# EAGLE design KO_V3 (EAGLE 9.6.2)
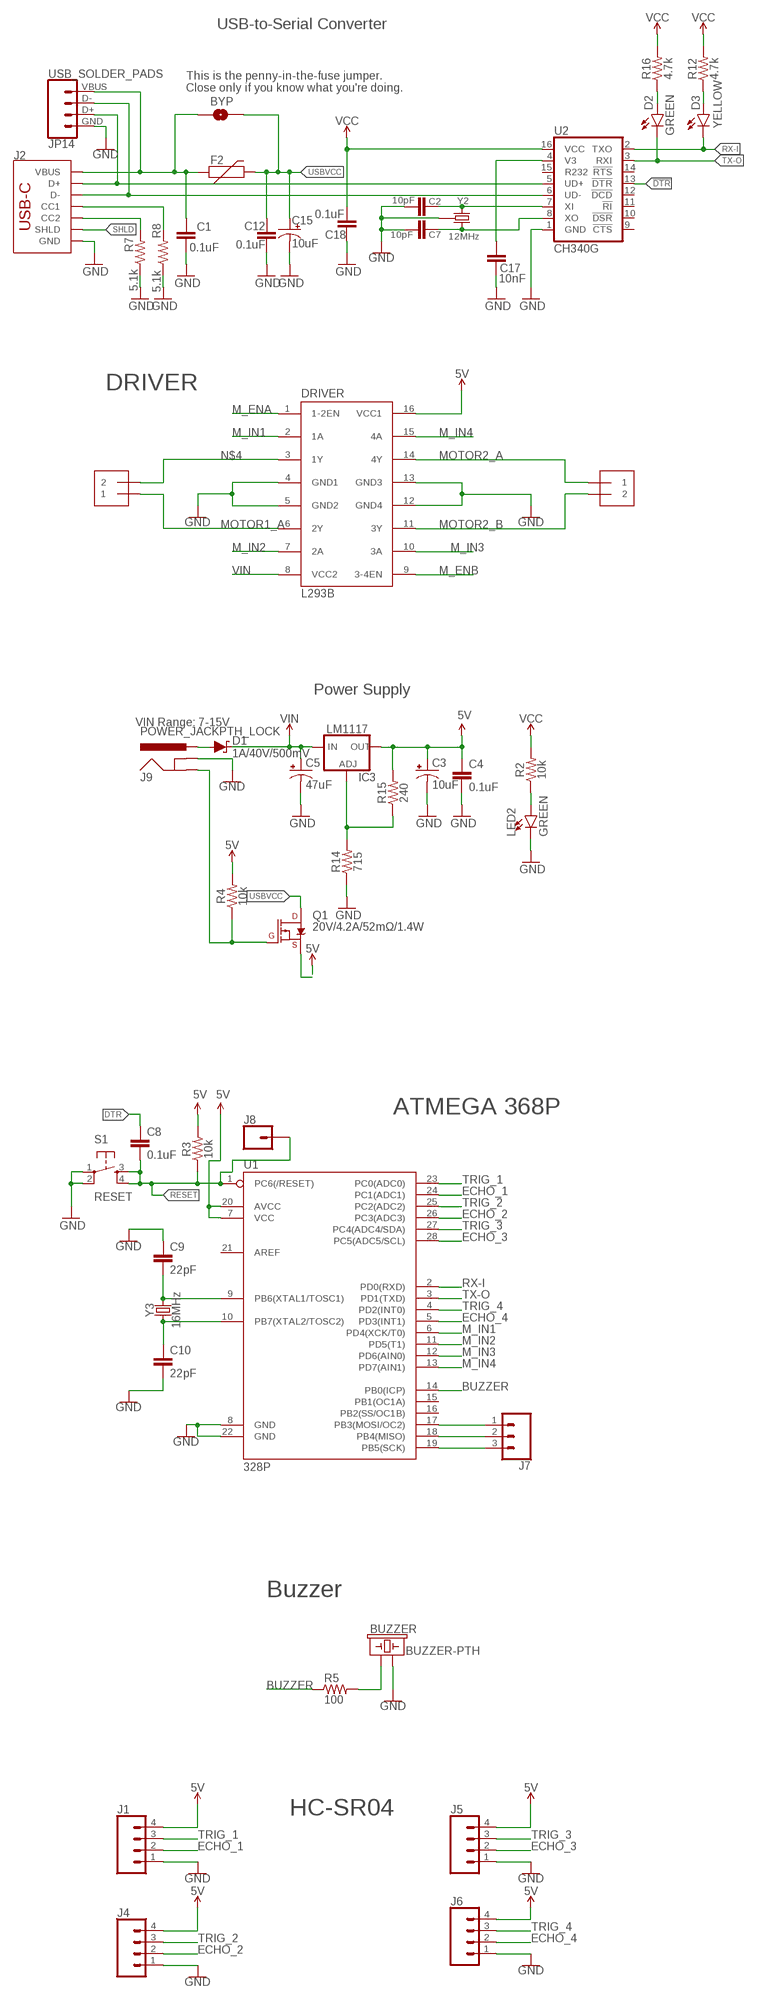
[diagram p0: schematic, sheet 1]

## Parts
BUZZER  BUZZER-PTH  [BUZZER-12MM]
BYP  JUMPER-SMT_2_NO_SILK  [SMT-JUMPER_2_NO_SILK]
C1  0.1uF  0.1UF-0603-25V-(+80/-20%)  [0603]
C2  10pF  10PF-0603-50V-5%  [0603]
C3  10uF  10UF-POLAR-EIA3216-16V-10%(TANT)  [EIA3216]
C4  0.1uF  0.1UF-0603-25V-(+80/-20%)  [0603]
C5  47uF  47UF-POLAR-PANASONIC_D-35V-20%  [PANASONIC_D]
C7  10pF  10PF-0603-50V-5%  [0603]
C8  0.1uF  0.1UF-0603-25V-(+80/-20%)  [0603]
C9  22pF  22PF-0603-50V-5%  [0603]
C10  22pF  22PF-0603-50V-5%  [0603]
C12  0.1uF  0.1UF-0603-25V-(+80/-20%)  [0603]
C15  10uF  10UF-POLAR-EIA3216-16V-10%(TANT)  [EIA3216]
C17  10nF  10NF-0603-50V-10%  [0603]
C18  0.1uF  0.1UF-0603-25V-(+80/-20%)  [0603]
D1  1A/40V/500mV  DIODE-SCHOTTKY-SS14  [SMA-DIODE]
D2  GREEN  LED-GREENLILYPAD  [LED-1206]
D3  YELLOW  LED-YELLOW_HIDDENSILK  [LED-1206-HIDDENSILK]
DRIVER  L293B  L293D  [DIL16]
F2  6V/2A  PPTC_6V2A  [1210]
IC3  LM1117  V_REG_LM1117SOT223  [SOT223]
J1  CONN_04  [1X04]
J2  USB Female Type C Connector  USB_C_2-LAYER_PADS  [USB-C-16P-2LAYER-PADS]
J4  CONN_04  [1X04]
J5  CONN_04  [1X04]
J6  CONN_04  [1X04]
J7  CONN_03LONGPADS  [1X03_LONGPADS]
J8  CONN_01OFFSET  [1X01_OFFSET]
J9  POWER_JACKPTH_LOCK  [POWER_JACK_PTH_LOCK]
JP14  USB_SOLDER_PADS  [USB-SOLDER-PADS]
LED2  GREEN  LED-GREENLILYPAD  [LED-1206]
MOTOR_1  1X2-3.5MM  [1X2-3.5MM]
MOTOR_2  1X2-3.5MM  [1X2-3.5MM]
Q1  20V/4.2A/52mΩ/1.4W  MOSFET_PCH-DMG2305UX-7  [SOT23-3]
R2  10k  10KOHM-0603-1/10W-1%  [0603]
R3  10k  10KOHM-0603-1/10W-1%  [0603]
R4  10k  10KOHM-0603-1/10W-1%  [0603]
R5  100  RC-MASTER-SMD_R_1206MP  [RC-MASTER-SMD_R1206MP]
R7  5.1k  5.1KOHM5.1KOHM-0603-1/10W-1%  [0603]
R8  5.1k  5.1KOHM5.1KOHM-0603-1/10W-1%  [0603]
R12  4.7k  4.7KOHM-0603-1/10W-1%  [0603]
R14  715  715OHM-0603-1/10W-1%  [0603]
R15  240  240OHM-0603-1/10W-1%  [0603]
R16  4.7k  4.7KOHM-0603-1/10W-1%  [0603]
S1  RESET  SWITCH_SPST_4_PINSQUARE  [TACTILE-SWITCH-SMD]
U1  328P  ATMEGA328P_PDIP  [DIP28]
U2  CH340G  CH340GSMD  [SO016]
Y2  12MHz  CRYSTAL-GROUNDEDSMD-3.2X2.5  [CRYSTAL-SMD-3.2X2.5MM]
Y3  16MHz  CRYSTAL-16MHZPTH-HC49US  [HC49US]

## Nets
5V: C3.+ C4.1 DRIVER.16(VCC1) IC3.2(OUT) IC3.4(OUT) J1.4 J4.4 J5.4 J6.4 Q1.2(S) R3.2 R4.2 R15.2 U1.7(VCC) U1.20(AVCC)
!DTR!: U2.13(!DTR)
BUZZER: R5.1 U1.14(PB0(ICP))
CC1: J2.A5(CC1) R8.2
CC2: J2.B5(CC2) R7.2
D+: J2.A6(D+) J2.B6(D+) JP14.D+ U2.5(UD+)
D-: J2.A7(D-) J2.B7(D-) JP14.D- U2.6(UD-)
DTR: C8.1
ECHO_1: J1.2 U1.24(PC1(ADC1))
ECHO_2: J4.2 U1.26(PC3(ADC3))
ECHO_3: J5.2 U1.28(PC5(ADC5/SCL))
ECHO_4: J6.2 U1.5(PD3(INT1))
GND [gnd]: BUZZER.- C1.2 C2.2 C3.- C4.2 C5.- C7.2 C9.1 C10.2 C12.2 C15.- C17.2 C18.2 DRIVER.4(GND1) DRIVER.5(GND2) DRIVER.12(GND4) DRIVER.13(GND3) J1.1 J2.GND J2.GND2(GND) J4.1 J5.1 J6.1 J9.GNDBREAK JP14.GND LED2.C R7.1 R8.1 R14.1 S1.1 S1.2 U1.8(GND) U1.22(GND) U2.1(GND) Y2.2(GND) Y2.4(GND)
INSERT: J9.GND Q1.1(G) R4.1
M_ENA: DRIVER.1(1-2EN)
M_ENB: DRIVER.9(3-4EN)
M_IN1: DRIVER.2(1A) U1.6(PD4(XCK/T0))
M_IN2: DRIVER.7(2A) U1.11(PD5(T1))
M_IN3: DRIVER.10(3A) U1.12(PD6(AIN0))
M_IN4: DRIVER.15(4A) U1.13(PD7(AIN1))
MOTOR1_A: DRIVER.6(2Y) MOTOR_2.1
MOTOR2_A: DRIVER.14(4Y) MOTOR_1.1
MOTOR2_B: DRIVER.11(3Y) MOTOR_1.2
N$1: C17.1 U2.4(V3)
N$2: C7.1 U2.8(XO) Y2.3
N$3: LED2.A R2.1
N$4: DRIVER.3(1Y) MOTOR_2.2
N$5: D2.A R16.1
N$6: BUZZER.+ R5.2
N$8: C2.1 U2.7(XI) Y2.1
N$9: D3.A R12.1
N$10: C9.2 U1.9(PB6(XTAL1/TOSC1)) Y3.2
N$14: C10.1 U1.10(PB7(XTAL2/TOSC2)) Y3.1
N$15: IC3.1(ADJ) R14.2 R15.1
N$23: J7.3 U1.19(PB5(SCK))
N$28: J7.2 U1.18(PB4(MISO))
N$29: J7.1 U1.17(PB3(MOSI/OC2))
PWRIN [power]: D1.A J9.PWR
RESET: C8.2 J8.1 R3.1 S1.3 S1.4 U1.1(PC6(/RESET))
RX-I: D3.C U1.2(PD0(RXD)) U2.2(TXO)
SHLD: J2.SHLD1(SHLD) J2.SHLD2(SHLD) J2.SHLD3(SHLD) J2.SHLD4(SHLD)
TRIG_1: J1.3 U1.23(PC0(ADC0))
TRIG_2: J4.3 U1.25(PC2(ADC2))
TRIG_3: J5.3 U1.27(PC4(ADC4/SDA))
TRIG_4: J6.3 U1.4(PD2(INT0))
TX-O: D2.C U1.3(PD1(TXD)) U2.3(RXI)
USBVCC [power]: BYP.2 C12.1 C15.+ F2.2 Q1.3(D)
VCC: C18.1 R2.2 R12.2 R16.2 U2.16(VCC)
VIN [power]: C5.+ D1.C DRIVER.8(VCC2) IC3.3(IN)
VUSB [power]: BYP.1 C1.1 F2.1 J2.VBUS1(VBUS) J2.VBUS2(VBUS) JP14.VBUS
Unconnected: U1.15(PB1(OC1A)) U1.16(PB2(SS/OC1B)) U1.21(AREF) U2.9(!CTS) U2.10(!DSR) U2.11(!RI) U2.12(!DCD) U2.14(!RTS) U2.15(R232)

## Notes on the sheet
- USB-to-Serial Converter
- This is the penny-in-the-fuse jumper.
  Close only if you know what you're doing.
- DRIVER
- Power Supply
- VIN Range: 7-15V
- ATMEGA 368P
- Buzzer
- HC-SR04

## Library data of the parts
BUZZER = SparkFun-Electromechanical:BUZZER: Buzzer Small round buzzers that operate around the audible 2kHz range. You can use these as speakers to create simple music or user interfaces. Variant Overview: PTH - Mini Speaker - PC Mount 12mm 2.048kHz <https://www.sparkfun.com/products/7950> PTH_KIT - Mini Speaker - PC Mount 12mm 2.048kHz <https://www.sparkfun.com/products/7950> KIT simplifies soldering by adding stop mask to one side of the pads. PTH_NO_SILK - Mini Speaker - PC Mount 12mm 2.048kHz <https://www.sparkfun.com/products/7950> No silkscreen indicator of buzzer outline. PTH_KIT_NO_SILK - Mini Speaker - PC Mount 12mm 2.048kHz <https://www.sparkfun.com/products/7950> KIT package w/o silkscreen SMD - Buzzer Audio Magnetic (CCV-084B16) SMD buzzer used on, e.g. the LilyPad Buzzer <https://www.sparkfun.com/products/8463> and RFID USB Reader <https://www.sparkfun.com/products/9963>. SMD_KIT - Buzzer Audio Magnetic (CCV-084B16) SMD Buzzer with elongated pins to make soldering easier. Used on the SparkFun Simon Says - Surface Mount Soldering Kit <https://www.sparkfun.com/products/10935>.; PROD_ID: COMP-08253; SF_SKU: COM-07950
BYP = SparkFun-Jumpers:JUMPER-SMT_2_NO: Normally open jumper This jumper has two pads in close proximity to each other. Apply solder to close the connection. Round pads are easier to solder for beginners, but are a lot larger. SparkFun Product that uses the round pads: SparkFun EL Sequencer <https://www.sparkfun.com/products/12781>
C1 C4 C8 C12 C18 = SparkFun-Capacitors:0.1UF: 0.1µF ceramic capacitors A capacitor is a passive two-terminal electrical component used to store electrical energy temporarily in an electric field.; PROD_ID: CAP-00810
C2 C7 = SparkFun-Capacitors:10PF: 10pF ceramic capacitors A capacitor is a passive two-terminal electrical component used to store electrical energy temporarily in an electric field.; PROD_ID: CAP-11812
C3 C15 = SparkFun-Capacitors:10UF-POLAR: 10.0µF polarized capacitors A capacitor is a passive two-terminal electrical component used to store electrical energy temporarily in an electric field.; PROD_ID: CAP-00811
C5 = SparkFun-Capacitors:47UF-POLAR: 47µF polarized capacitors A capacitor is a passive two-terminal electrical component used to store electrical energy temporarily in an electric field.; PROD_ID: CAP-08478
C9 C10 = SparkFun-Capacitors:22PF: 22pF ceramic capacitors A capacitor is a passive two-terminal electrical component used to store electrical energy temporarily in an electric field.; PROD_ID: CAP-07876
C17 = SparkFun-Capacitors:10NF: 0.01uF/10nF/10,000pF ceramic capacitors A capacitor is a passive two-terminal electrical component used to store electrical energy temporarily in an electric field. CAP-09321; PROD_ID: CAP-00867
D1 = SparkFun-DiscreteSemi:DIODE-SCHOTTKY: Schottky diode A Schottky diode is a semiconductor diode which has a low forward voltage drop and a very fast switching action.; PROD_ID: DIO-08053
D2 LED2 = SparkFun-LED:LED-GREEN: Green SMD LED Used in manufacturing of various products at SparkFun Packages: 0603 - SMD 0603 package [Product Link] <http://www.futureelectronics.com/en/technologies/semiconductors/optoelectronics/leds/Pages/9894312-LTST-C190GKT.aspx?CrossPart=HSMG-C190&IM=0> LilyPad 1206 - SMD1206 LilyPad package [Product Link] <http://www.futureelectronics.com/en/Technologies/Product.aspx?ProductID=IN150NGHARVATEKCORPORATION2049943&IM=0> 1206 - SMD1206 package [Product Link] <http://www.futureelectronics.com/en/technologies/semiconductors/optoelectronics/leds/Pages/8315665-LTST-C150KGKT.aspx?IM=0> 1206 Bottom Mount -SMD 1206 Bottom Mount [Product Link] <http://www.digikey.com/product-detail/en/lite-on-inc/LTST-C230KGKT/160-1456-1-ND/386854> SparkFun Products: Pro Mini 328 -5V <https://www.sparkfun.com/products/821> RedBoard <https://www.sparkfun.com/products/12757> MP3 Trigger <https://www.sparkfun.com/products/13720> Makey Makey <https://www.sparkfun.com/products/11076>; PROD_ID: DIO-09910
D3 = SparkFun-LED:LED-YELLOW: Yellow SMD LED Used in manufacturing several products at SparkFun. Packages: 0603 - SMD 0603 package[Product Link] <http://www.kingbrightusa.com/product.asp?catalog_name=LED&product_id=APT1608SYCK> 0603 -SMART - SMART SMD 0603 package (more efficient/more expensive) [Product Link] <http://www.osram-os.com/osram_os/en/products/product-catalog/led-light-emitting-diodes/smartled-0603/ly-l29k/index.jsp> LilyPad - SMD1206 package[Product Datasheet] <https://www.sparkfun.com/datasheets/DevTools/LilyPad/Q150YUS4.pdf> SparkFun Products: Blynk Board <https://www.sparkfun.com/products/13794> IOIO-OTG <https://www.sparkfun.com/products/13613> XBee Explorer Serial <https://www.sparkfun.com/products/13225>; PROD_ID: DIO-09909
DRIVER = st-microelectronics:L293D: PUSH-PULL 4 CHANNEL DRIVER; MPN: L293D; OC_FARNELL: 9589619; OC_NEWARK: 56P8249
F2 = SparkFun-Fuses:PPTC: Resettable Fuse PPTC Resettable Fuse. Really a sort of resistor with a polymeric positive temperature coefficient whose resistance increases dramatically with an increase in temperature. When heated by the power passing through the resistance rises causing the current to be limited, protecting the circuit. This is achieved by the transition of the polymer from a crystalline to an amorphous state where the conductive carbon separates breaking the conductive pathways found in the cool crystalline structure. When a PPTC cools back down it resumes conducting letting the circuit turn back on. SparkFun Products: SparkFun RedBoard - Programmed with Arduino <https://www.sparkfun.com/products/12757> Pro Micro - 5V/16MHz <https://www.sparkfun.com/products/12640> Arduino Pro 328 - 5V/16MHz <https://www.sparkfun.com/products/10915> MP3 Trigger <https://www.sparkfun.com/products/13720>; PROD_ID: RES-14313
IC3 = SparkFun-IC-Power:V_REG_LM1117: Voltage Regulator LM1117 Standard adjustable voltage regulator but in SMD form. Spark Fun Electronics SKU : COM-00595; PROD_ID: VREG-08170
J1 J4-J6 = SparkFun-Connectors:CONN_04: Multi connection point. Often used as Generic Header-pin footprint for 0.1 inch spaced/style header connections On any of the 0.1 inch spaced packages, you can populate with these: Break Away Headers - Straight <https://www.sparkfun.com/products/116> (PRT-00116) Break Away Male Headers - Right Angle <https://www.sparkfun.com/products/553> (PRT-00553) Female Headers <https://www.sparkfun.com/products/115> (PRT-00115) Break Away Headers - Machine Pin <https://www.sparkfun.com/products/117> (PRT-00117) Break Away Female Headers - Swiss Machine Pin <https://www.sparkfun.com/products/743> (PRT-00743) For SCREWTERMINALS and SPRING TERMINALS visit here: Screw Terimnals on SparkFun.com <https://www.sparkfun.com/search/results?term=Screw+Terminals> (5mm/3.5mm/2.54mm spacing) This device is also useful as a general connection point to wire up your design to another part of your project. Our various solder wires solder well into these plated through hole pads. Hook-Up Wire - Assortment (Stranded, 22 AWG) <https://www.sparkfun.com/products/11375> (PRT-11375) Hook-Up Wire - Assortment (Solid Core, 22 AWG) <https://www.sparkfun.com/products/11367> (PRT-11367) View the entire wire category on our website here <https://www.sparkfun.com/categories/141> Special notes: Molex polarized connector foot print use with SKU : PRT-08231 with associated crimp pins and housings. 1MM SMD Version SKU: PRT-10208; PROD_ID: CONN-09696
J2 = SparkFun-Connectors:USB_C: USB Type C 16Pin Connector Super Speed pins not available on the 16-pin purely SMD connector so this part is best for USB 2.0 implementations. D1 and D2 are tied together enabling D+/- no matter which way the cable is plugged into the connector. The two channel configuration pins (CC1/2) are exposed. These are normally connected to ground via 5.1k resistors but can be reconfigured for high current/high power applications. **4-LAYER BOARD WARNING!!** If designing 4-layer board, make sure to select the variant _4-LAYER-ISOLATED. The linked footprint (USB-C-16-4LAYER-ISOLATED) includes some very necessary cutout polygons in the inner layers (2 and 15). This prevents the PTH mounting shield legs on the USB connector from electrically connecting any other polygons on the inner layers (usually VCC and GND).; PROD_ID: CONN-14122
J7 = SparkFun-Connectors:CONN_03: Multi connection point. Often used as Generic Header-pin footprint for 0.1 inch spaced/style header connections On any of the 0.1 inch spaced packages, you can populate with these: Break Away Headers - Straight <https://www.sparkfun.com/products/116> (PRT-00116) Break Away Male Headers - Right Angle <https://www.sparkfun.com/products/553> (PRT-00553) Female Headers <https://www.sparkfun.com/products/115> (PRT-00115) Break Away Headers - Machine Pin <https://www.sparkfun.com/products/117> (PRT-00117) Break Away Female Headers - Swiss Machine Pin <https://www.sparkfun.com/products/743> (PRT-00743) Stackable Header - 3 Pin (Female, 0.1") <https://www.sparkfun.com/products/13875> (PRT-13875) For SCREWTERMINALS and SPRING TERMINALS visit here: Screw Terimnals on SparkFun.com <https://www.sparkfun.com/search/results?term=Screw+Terminals> (5mm/3.5mm/2.54mm spacing) This device is also useful as a general connection point to wire up your design to another part of your project. Our various solder wires solder well into these plated through hole pads. Hook-Up Wire - Assortment (Stranded, 22 AWG) <https://www.sparkfun.com/products/11375> (PRT-11375) Hook-Up Wire - Assortment (Solid Core, 22 AWG) <https://www.sparkfun.com/products/11367> (PRT-11367) View the entire wire category on our website here <https://www.sparkfun.com/categories/141> Special notes: Molex polarized connector foot print use with SKU : PRT-08232 with associated crimp pins and housings.
J8 = SparkFun-Connectors:CONN_01: Single connection point. Often used as Generic Header-pin footprint for 0.1 inch spaced/style header connections On any of the 0.1 inch spaced packages, you can populate with these: Break Away Headers - Straight <https://www.sparkfun.com/products/116> (PRT-00116) Break Away Male Headers - Right Angle <https://www.sparkfun.com/products/553> (PRT-00553) Female Headers <https://www.sparkfun.com/products/115> (PRT-00115) Break Away Headers - Machine Pin <https://www.sparkfun.com/products/117> (PRT-00117) Break Away Female Headers - Swiss Machine Pin <https://www.sparkfun.com/products/743> (PRT-00743) This device is also useful as a general connection point to wire up your design to another part of your project. Our various solder wires solder well into these plated through hole pads. Hook-Up Wire - Assortment (Stranded, 22 AWG) <https://www.sparkfun.com/products/11375> (PRT-11375) Hook-Up Wire - Assortment (Solid Core, 22 AWG) <https://www.sparkfun.com/products/11367> (PRT-11367) View the entire wire category on our website here <https://www.sparkfun.com/categories/141> Special notes: SMTSO-256-ET is a "flush mount" nut for a 4-40 screw. We mostly use this on specialty testbeds; it is a nice way to connect hardware to your PCB at an adjustable hieght. Also note, the SNAP packages are for using a snappable style connector. We sell a baggie of snaps and they are also used on two LilyPad designs: Snap Assortment - 30 pack (male and female) <https://www.sparkfun.com/products/11347> (DEV-11347) LilyPad Arduino SimpleSnap <https://www.sparkfun.com/products/10941> (DEV-10941) LilyPad SimpleSnap Protoboard <https://www.sparkfun.com/products/10940> (DEV-10940)
J9 = SparkFun-Connectors:POWER_JACK: Power Jack Connector This is the standard 5.5mm barrel jack for power. The PTH is the most common, proven, reliable, footprint. The Slot footprint only works if the mill layer is transmitted to the PCB fab house so be warned. Here are the connectors we sell at SparkFun: DC Barrel Power Jack/Connector <https://www.sparkfun.com/products/119> (PRT-00119) DC Barrel Power Jack/Connector (SMD) <https://www.sparkfun.com/products/12748> (PRT-12748) DC Barrel Jack Adapter - Breadboard Compatible <https://www.sparkfun.com/products/10811> (PRT-10811) It is used on this SparkFun product (and many, many others): SparkFun RedBoard - Programmed with Arduino <https://www.sparkfun.com/products/12757> (DEV-12757) Also, if you need a mating power supply or connector, please check these out: Wall Adapter Power Supply - 9VDC 650mA <https://www.sparkfun.com/products/298> (TOL-00298) DC Barrel Jack Adapter - Male <https://www.sparkfun.com/products/10287> (PRT-10287); PROD_ID: CONN-08197; SF_ID: PRT-00119
JP14 = SparkFun-Connectors:USB_SOLDER_PADS: Solder pad access to USB pins. Helpful to expose on PCBs so user can attach external USB connector if necessary.
MOTOR_1 MOTOR_2 = adafruit:1X2: 3.5mm Terminal block http://www.ladyada.net/library/pcb/eaglelibrary.html
Q1 = SparkFun-DiscreteSemi:MOSFET_PCH: P-channel MOSFETs Voltage controlled devices that allow control of high current outputs. SparkFun Products: SparkFun ESP32 Thing <https://www.sparkfun.com/products/13907> SparkFun ESP8266 Thing <https://www.sparkfun.com/products/13231> SparkFun Pi Servo HAT V2 <https://www.sparkfun.com/products/15316> DMG2305UX-7 (20V/4.2A/SOT23-3); PROD_ID: TRANS-14388
R2-R4 = SparkFun-Resistors:10KOHM: 10kΩ resistor A resistor is a passive two-terminal electrical component that implements electrical resistance as a circuit element. Resistors act to reduce current flow, and, at the same time, act to lower voltage levels within circuits. - Wikipedia; PROD_ID: RES-00824
R5 = 52101-101-REV-A_v16:RC-MASTER-SMD_R_: RESISTOR
R7 R8 = SparkFun-Resistors:5.1KOHM; PROD_ID: RES-12083
R12 R16 = SparkFun-Resistors:4.7KOHM: 4.7kΩ resistor A resistor is a passive two-terminal electrical component that implements electrical resistance as a circuit element. Resistors act to reduce current flow, and, at the same time, act to lower voltage levels within circuits. - Wikipedia; PROD_ID: RES-07857
R14 = SparkFun-Resistors:715OHM: 715Ω resistor A resistor is a passive two-terminal electrical component that implements electrical resistance as a circuit element. Resistors act to reduce current flow, and, at the same time, act to lower voltage levels within circuits. - Wikipedia; PROD_ID: RES-07850
R15 = SparkFun-Resistors:240OHM: 240Ω resistor A resistor is a passive two-terminal electrical component that implements electrical resistance as a circuit element. Resistors act to reduce current flow, and, at the same time, act to lower voltage levels within circuits. - Wikipedia; PROD_ID: RES-07849
S1 = SparkFun-Electromechanical:SWITCH_SPST_4_PIN; PROD_ID: SWCH-08247
U1 = SparkFun-IC-Microcontroller:ATMEGA328P_PDIP: Atmel 328P Through hole ATMEGA328P uC used in the Arduino 32kb flash, 1k EEPROM, 2k SRAM Datasheet <http://www.sparkfun.com/datasheets/Components/SMD/ATMega328.pdf> SparkFun Products Storefront component: AVR 28 Pin 20MHz 32K 6A/D - ATMega328P <https://www.sparkfun.com/products/9061> (COM-09061) SparkFun Simon Says - Through-Hole Soldering Kit <https://www.sparkfun.com/products/10547> (KIT-10547) SparkFun Learn to Solder - Simon Says <https://www.sparkfun.com/products/13708> (KIT-13708) SparkFun BigTime Watch Kit <https://www.sparkfun.com/products/11734> (KIT-11734) SparkFun ClockIt <https://www.sparkfun.com/products/10930> (KIT-10930) SparkFun Serial Enabled LCD Kit <https://www.sparkfun.com/products/10097> (LCD-10097) SparkFun Simon Tilts - Through Hole Soldering Kit <https://www.sparkfun.com/products/12634> (KIT-12634) SparkFun Frequency Counter Kit <https://www.sparkfun.com/products/10140> (KIT-10140) FabFM Radio Kit <https://www.sparkfun.com/products/11043> (KIT-11043) SparkFun Binary Blaster Kit <https://www.sparkfun.com/products/12037> (KIT-12037) SparkFun Metro-Gnome <https://www.sparkfun.com/products/9236> (KIT-09236) ATmega328 with Arduino Optiboot (Uno) <https://www.sparkfun.com/products/10524> (DEV-10524); PROD_ID: IC-09136
U2 = SparkFun-IC-Comms:CH340G: A simple USB 2.0 to Serial IC.; PROD_ID: IC-13498
Y2 = SparkFun-Clocks:CRYSTAL-GROUNDED: Crystals w/ Ground Pin (Generic) These are passive quartz crystals, which can be used as a clock source for a microcontroller. Crystal's are usually two-terminal devices. A third terminal may be optionally connected to ground, as recommended by the manufaturer.; PROD_ID: XTAL-13518
Y3 = SparkFun-Clocks:CRYSTAL-16MHZ: 16MHz Crystal Digikey Example <http://www.digikey.com/product-search/en?keywords=535-9122-1-ND> Frequency: 16MHz Frequency Stability: ±50ppm Frequency Tolerance: ±20ppm Load Capacitance: 18pF SparkFun Products: Pro Micro -5V/16MHz <https://www.sparkfun.com/products/12640> SparkFun Serial Enabled LCD Kit <https://www.sparkfun.com/products/10097>; PROD_ID: XTAL-08181; SF_ID: COM-00536

## Net classes
0 default: width 0 mm, drill 0 mm
1 power: width 0.762 mm
2 gnd: width 0.305 mm, drill 0.559 mm, clearance 0.254 mm

## Board
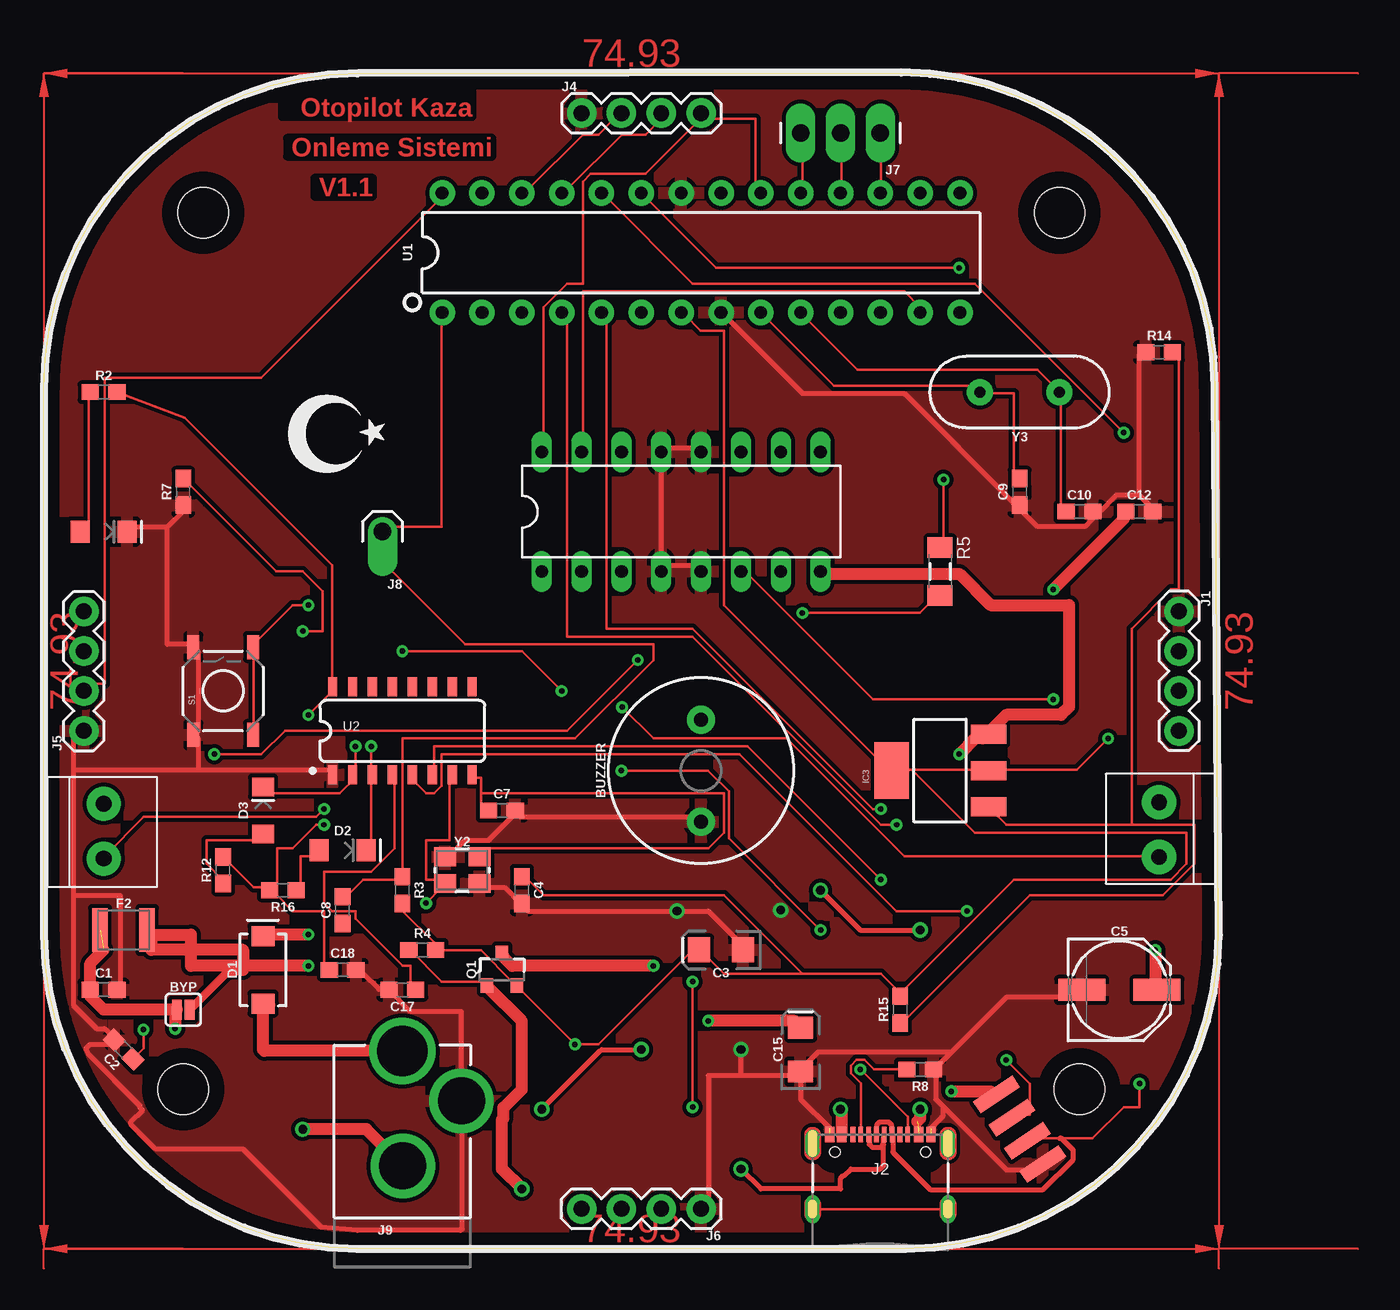
[diagram p1: board, top side]
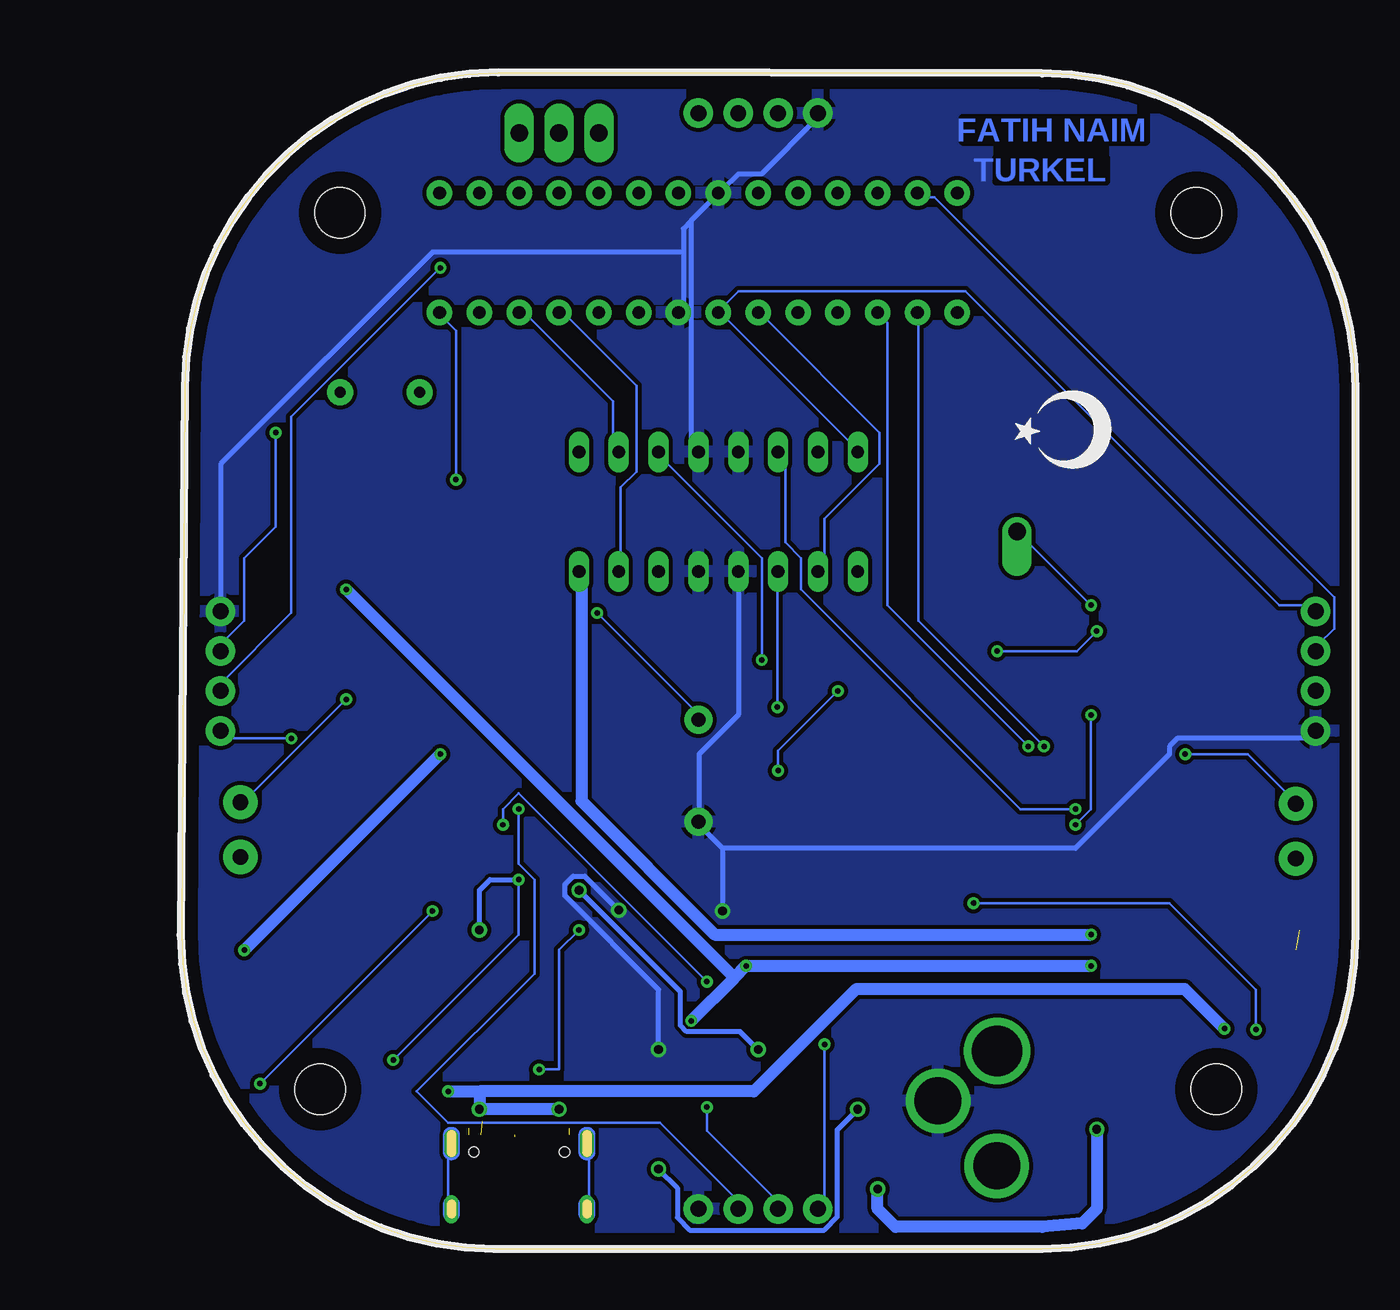
[diagram p2: board, bottom side, seen from below]

Size 74.87 x 74.93 mm. Coordinates in mm from the lower left corner, seen from the top.
Outline: 20,74.93 54.67,74.93 arc-90 74.67,55 74.87,20.07 arc-90 54.87,0 20,0 arc-90 0,20 0,54.93 arc-90 20,74.93
Copper layers (1*16): Top 0.035mm / dielectric 1.5mm / Bottom 0.035mm
Design rules "default": minimum track width 6mil, minimum drill 0.35mm, track to track 6mil, track to pad 6mil, pad to pad 6mil, via to via 6mil, smd to smd 6mil, copper to edge 40mil, drill to drill 6mil, minimum pad ring 10mil, minimum via ring 8mil, stop-mask expansion 4mil, vias tented up to drill 0mil, thermal gap 10mil
Holes 3.2 mm at 10.16,66.04 8.89,10.16 66.04,10.16 64.77,66.04

### Footprints (pad centres in the part's own frame; a part is rotated, then mirrored left to right if it is on the bottom)
BUZZER-12MM = drill 0.9 pad 1.778: + 3.25,0; - -3.25,0
SMT-JUMPER_2_NO_SILK = smd 0.635 x 1.27: 1 -0.406,0; 2 0.406,0
0603 = smd 1.1 x 1: 1 -0.85,0; 2 0.85,0
EIA3216 = smd 1.4 x 1.6: + 1.4,0; - -1.4,0
PANASONIC_D = smd 3 x 1.4: + 2.4,0; - -2.4,0
SMA-DIODE = smd 1.27 x 1.47: A -2.15,0; C 2.15,0
LED-1206 = smd 1.2 x 1.4: A -1.5,0; C 1.5,0
LED-1206-HIDDENSILK = smd 1.2 x 1.4: A -1.5,0; C 1.5,0
DIL16 = drill 0.813 long: 1 -8.89,-3.81; 2 -6.35,-3.81; 3 -3.81,-3.81; 4 -1.27,-3.81; 5 1.27,-3.81; 6 3.81,-3.81; 7 6.35,-3.81; 8 8.89,-3.81; 9 8.89,3.81; 10 6.35,3.81; 11 3.81,3.81; 12 1.27,3.81; 13 -1.27,3.81; 14 -3.81,3.81; 15 -6.35,3.81; 16 -8.89,3.81
1210 = smd 1 x 2.8: 1 -1.5,0; 2 1.5,0
SOT223 = smd 1.219 x 2.235: 1 -2.311,-3.099; 2 0,-3.099; 3 2.311,-3.099 | smd 3.6 x 2.2: 4 0,3.099
1X04 = drill 1.016 pad 1.88: 1 0,0; 2 2.54,0; 3 5.08,0; 4 7.62,0
USB-C-16P-2LAYER-PADS = smd 0.3 x 1: A5 -1.25,-0.34; A6 -0.25,-0.34; A7 0.25,-0.34; A8 1.25,-0.34; B5 1.75,-0.34; B6 0.75,-0.34; B7 -0.75,-0.34; B8 -1.75,-0.34 | smd 0.6 x 1: GND -3.225,-0.34; GND2 3.225,-0.34; VBUS1 -2.45,-0.34; VBUS2 2.45,-0.34 | drill 0.4 pad 0.6 long: SHLD1 -4.318,-0.915; SHLD2 4.318,-0.915; SHLD3 -4.318,-5.095; SHLD4 4.318,-5.095 | hole 0.65: -2.89,-1.445; 2.89,-1.445
1X03_LONGPADS = drill 1.118 pad 1.88 long: 1 0,0; 2 2.54,0; 3 5.08,0
1X01_OFFSET = drill 1.118 pad 1.88 offset: 1 0,0
POWER_JACK_PTH_LOCK = drill 2.997 pad 4.115: GND 0.025,6.557; GNDBREAK 3.762,10.7 | drill 3.2 pad 4.115: PWR 0,13.878
USB-SOLDER-PADS = smd 3 x 0.9: D+ 0,-0.889; D- 0,0.889; GND 0,-2.667; VBUS 0,2.667
1X2-3.5MM = drill 1 pad 2.184: 1 1.8,0; 2 -1.7,0
SOT23-3 = smd 0.8 x 0.9: 1 -0.95,-1; 2 0.95,-1; 3 0,1.1
RC-MASTER-SMD_R1206MP = smd 1.3 x 1.6: 1 -1.524,0; 2 1.524,0
TACTILE-SWITCH-SMD = smd 1.524 x 0.762: 1 -2.794,1.905; 2 2.794,1.905; 3 -2.794,-1.905; 4 2.794,-1.905
DIP28 = drill 0.813 pad 1.626: 1 -16.51,-3.81; 2 -13.97,-3.81; 3 -11.43,-3.81; 4 -8.89,-3.81; 5 -6.35,-3.81; 6 -3.81,-3.81; 7 -1.27,-3.81; 8 1.27,-3.81; 9 3.81,-3.81; 10 6.35,-3.81; 11 8.89,-3.81; 12 11.43,-3.81; 13 13.97,-3.81; 14 16.51,-3.81; 15 16.51,3.81; 16 13.97,3.81; 17 11.43,3.81; 18 8.89,3.81; 19 6.35,3.81; 20 3.81,3.81; 21 1.27,3.81; 22 -1.27,3.81; 23 -3.81,3.81; 24 -6.35,3.81; 25 -8.89,3.81; 26 -11.43,3.81; 27 -13.97,3.81; 28 -16.51,3.81
SO016 = smd 0.6 x 1.2: 1 -4.445,-2.8; 2 -3.175,-2.8; 3 -1.905,-2.8; 4 -0.635,-2.8; 5 0.635,-2.8; 6 1.905,-2.8; 7 3.175,-2.8; 8 4.445,-2.8; 9 4.445,2.8; 10 3.175,2.8; 11 1.905,2.8; 12 0.635,2.8; 13 -0.635,2.8; 14 -1.905,2.8; 15 -3.175,2.8; 16 -4.445,2.8
CRYSTAL-SMD-3.2X2.5MM = smd 1.4 x 1.2: 1 -1.1,-0.85; 2 1.1,-0.85; 3 1.1,0.85; 4 -1.1,0.85
HC49US = drill 0.7 pad 1.651: 1 -2.54,0; 2 2.54,0

### Placement (x,y rotation side)
BUZZER  41.91,30.48 90 top
BYP  8.89,15.24 0 top
C1  3.81,16.51 0 top
C2  5.08,12.7 135 top
C3  43.18,19.05 180 top
C4  30.48,22.86 270 top
C5  68.58,16.51 0 top
C7  29.21,27.94 0 top
C8  19.05,21.59 90 top
C9  62.23,48.26 90 top
C10  66.04,46.99 0 top
C12  69.85,46.99 0 top
C15  48.26,12.7 90 top
C17  22.86,16.51 180 top
C18  19.05,17.78 0 top
D1  13.97,17.78 90 top
D2  19.05,25.4 0 top
D3  13.97,27.94 90 top
DRIVER  40.64,46.99 0 top
F2  5.08,20.32 0 top
IC3  57.15,30.48 90 top
J1  72.39,40.64 270 top
J2  53.34,7.62 0 top
J4  34.29,72.39 0 top
J5  2.54,33.02 90 top
J6  41.91,2.54 180 top
J7  53.34,71.12 180 top
J8  21.59,45.72 180 top
J9  22.86,-1.27 0 top
JP14  62.23,7.62 33.7 top
LED2  3.81,45.72 0 top
MOTOR_1  3.81,26.67 270 top
MOTOR_2  71.12,26.67 90 top
Q1  29.21,17.78 0 top
R2  3.81,54.61 0 top
R3  22.86,22.86 270 top
R4  24.13,19.05 0 top
R5  57.15,43.18 270 top
R7  8.89,48.26 90 top
R8  55.88,11.43 180 top
R12  11.43,24.13 90 top
R14  71.12,57.15 0 top
R15  54.61,15.24 90 top
R16  15.24,22.86 180 top
S1  11.43,35.56 90 top
U1  41.91,63.5 0 top
U2  22.86,33.02 0 top
U$2  [TR_MINI]  14.39,48.91 0 top
U$4  [TR_MINI]  14.39,55.26 180 bottom
Y2  26.67,24.13 0 top
Y3  62.23,54.61 180 top

### Tracks (layer width: path | path; a pad name or v marks a point on that pad's centre or on a via)
5V  (via drill 0.35)
  Top 0.152: 48.37,17.53 43.37,17.53 41.87,19.03 C3.+ 41.37,19.03 35.37,13.03 v33.87,13.03 30.37,16.53 Q1.2 29.87,17.03 27.87,19.03 25.37,19.03 R4.2 24.87,19.53 22.87,21.53 R3.2 | 48.37,17.53 53.37,17.53 54.37,16.53 R15.2 54.87,16.53 61.87,23.53 71.87,23.53 72.87,24.53 72.87,26.53 59.37,26.53 55.37,30.53 | 48.37,17.53 43.37,22.53 31.87,22.53 30.87,23.53 C4.1 | 55.37,30.53 54.37,30.53 IC3.4 53.87,30.53 43.37,41.03 43.37,58.53 41.87,58.53 40.87,59.53 U1.7 | 55.37,30.53 59.87,30.53 IC3.2 60.37,30.53 65.87,30.53 v67.87,32.53 | U1.20 45.37,67.53 45.37,72.03 42.37,72.03 J4.4 41.87,72.03 38.37,68.53 34.87,68.53 34.37,68.03 34.37,61.53 33.37,61.53 31.87,60.03 31.87,51.03 DRIVER.16
  Bottom 0.152: v33.87,13.03 33.87,3.03 J6.4 | v67.87,32.53 72.37,32.53 J1.4 | DRIVER.16 31.87,51.03 40.37,59.53 U1.7 40.37,60.03 39.37,61.03 24.87,61.03 4.87,41.03 2.87,41.03 J5.4
BUZZER  (via drill 0.35)
  Top 0.152: v57.37,49.03 57.37,45.03 R5.1
  Bottom 0.152: v57.37,49.03 57.37,58.53 58.37,59.53 U1.14
CC1
  Top 0.152: R8.2 52.93,11.43 52.32,12.04 51.82,12.04 51.46,11.68 51.46,11.18 52.09,10.55 J2.A5
CC2  (via drill 0.35)
  Top 0.152: R7.2 14.82,43.18 16.51,43.18 17.78,41.91 17.78,39.37 v16.51,39.37 | v22.86,38.1 30.48,38.1 v33.02,35.56 | v49.53,20.32 43.68,26.17 43.68,29.16 42.35,30.48 v36.83,30.48 | v52.07,11.43 55.09,8.41 J2.B5
  Bottom 0.152: v16.51,39.37 17.78,38.1 v22.86,38.1 | v33.02,35.56 36.83,31.75 v36.83,30.48 | v49.53,20.32 50.8,19.05 50.8,11.43 v52.07,11.43
D+  (via drill 0.35)
  Top 0.152: v58.87,21.53 54.37,21.53 44.37,31.53 25.37,31.53 25.37,29.53 24.87,29.03 24.37,29.03 23.37,30.03 U2.5 | v69.87,10.53 69.87,9.03 68.87,9.03 66.87,7.03 64.77,7.03 62.87,7.03 JP14.D+
  Top 0.305: J2.A6 53.14,7.33 53.14,7.91 53.31,8.09 53.87,8.09 54.05,7.91 54.05,7.33 J2.B6 54.14,7.23 54.14,6.16 56.53,3.76 63.72,3.76 65.64,5.68 65.64,6.29 64.9,7.03 64.77,7.03
  Bottom 0.152: v69.87,10.53 v58.87,21.53
D-  (via drill 0.35, 0.56)  (1 unrouted)
  Top 0.152: v53.37,23.53 44.87,32.03 24.87,32.03 24.87,30.53 U2.6 | v61.37,12.03 62.87,10.53 62.87,8.53 61.87,8.53 JP14.D-
  Top 0.305: 53.55,6.65 53.37,6.47 52.81,6.47 52.63,6.66 52.63,7.24 J2.B7 | 53.55,6.65 53.55,7.09 53.59,7.13 | v44.45,5.08 45.72,3.81 50.8,3.81 50.8,4.49 50.99,4.68 51.07,4.68 51.47,5.08 53.34,5.08 53.55,5.28 53.55,6.65 | v31.75,8.89 35.51,12.65 35.53,12.65 35.58,12.7 v38.1,12.7 | v49.53,22.86 52.07,20.32 v55.88,20.32
  Bottom 0.152: v53.37,23.53 53.37,20.03 v61.37,12.03
  Bottom 0.305: v31.75,8.89 33.05,7.59 33.05,2.02 33.88,1.19 42.47,1.19 43.26,1.98 43.26,3.89 v44.45,5.08 | v38.1,12.7 39.24,13.84 42.65,13.84 43.06,14.25 43.06,16.39 v49.53,22.86 | v55.88,20.32 55.88,22.86 55.21,23.53 v53.37,23.53
ECHO_1  (via drill 0.35)
  Top 0.152: v68.87,52.03 59.37,61.53 41.37,61.53 35.87,67.03 U1.24
  Bottom 0.152: v68.87,52.03 68.87,46.03 70.87,44.03 70.87,40.03 72.37,38.53 J1.2
ECHO_2
  Top 0.152: U1.26 30.87,67.53 34.37,71.03 35.37,71.03 36.37,72.03 J4.2
ECHO_3
  Top 0.152: U1.28 25.37,67.03 13.87,55.53 3.87,55.53 3.87,36.03 2.87,36.03 J5.2
ECHO_4  (via drill 0.35)
  Top 0.152: v53.37,28.03 52.87,28.03 41.37,39.53 35.87,39.53 35.87,59.53 U1.5
  Bottom 0.152: v53.37,28.03 53.37,24.53 52.37,23.53 52.37,17.53 59.87,10.03 57.87,8.03 44.37,8.03 39.37,3.03 J6.2
GND  (via drill 0.56)  (3 unrouted)
  Top 0.305: Y2.2 27.87,23.03 29.37,23.03 30.37,22.03 C4.2 30.87,21.53 v40.37,21.53 42.37,21.53 44.37,19.53 C3.- | Y2.4 25.87,25.03 26.87,26.03 28.37,26.03 29.87,27.53 C7.2 30.37,27.53 41.87,27.53 BUZZER.- | 69.87,48.03 68.37,48.03 67.37,47.03 C10.2 66.87,46.53 66.37,46.03 63.37,46.03 62.37,47.03 C9.1 61.87,47.53 54.87,54.53 48.37,54.53 43.37,59.53 U1.8 | 69.87,48.03 70.87,47.03 C12.2 | 69.87,48.03 69.87,57.03 R14.1 | 39.37,43.53 41.87,43.53 DRIVER.5 | DRIVER.12 41.87,51.03 39.37,51.03 DRIVER.13 39.37,43.53 | 39.37,43.53 DRIVER.4 | 7.87,46.03 8.87,47.03 R7.1 | 7.87,46.03 5.37,46.03 LED2.C | 1.87,30.53 1.87,32.53 2.37,32.53 J5.1 | 1.87,30.53 1.87,22.53 | 1.87,22.53 1.87,15.53 3.37,14.03 3.87,14.03 4.37,13.53 C2.2 4.37,13.03 2.94,13.03 2.68,12.76 2.85,12.39 6.12,9.12 6.12,9.01 6.3,8.84 5.54,8.08 5.54,7.94 7.13,6.35 12.7,6.35 17.68,1.37 20,1.17 26.57,1.17 26.67,1.27 26.62,1.32 J9.GNDBREAK 26.62,15.12 23.4,15.12 C17.2 21.87,16.53 21.37,16.53 20.37,17.53 C18.2 | 1.87,22.53 4.87,22.53 4.87,16.53 C1.2 | 1.87,30.53 9.87,30.53 | 9.87,30.53 18.37,30.53 U2.1 | 9.87,30.53 9.87,32.53 S1.1 9.87,33.03 9.87,38.03 S1.2 9.37,38.53 7.87,38.53 7.87,46.03 | 57.87,12.53 61.37,16.03 65.87,16.03 C5.- | 57.87,12.53 56.87,11.53 R8.1 56.87,11.03 56.87,9.53 57.33,9.07 | 57.87,12.53 49.37,12.53 48.37,11.53 C15.- | 57.33,9.07 61.37,5.03 63.37,5.03 JP14.GND | 44.45,11.03 47.87,11.03 C15.- | 44.45,11.03 42.37,11.03 42.37,3.03 J6.1 | 56.73,7.83 56.56,7.67 | 57.33,9.07 57.33,8.43 56.58,7.68 56.58,7.67 | C15.- 48.26,9.52 50.12,7.67 | 44.45,11.03 v44.45,12.7
  Bottom 0.305: 40.37,25.53 v40.37,21.53 | 40.37,25.53 41.87,27.03 BUZZER.- 41.87,27.53 41.87,31.53 39.37,34.03 DRIVER.4 | 42.87,63.53 42.87,65.03 42.37,65.53 | 42.87,63.53 42.87,60.03 U1.8 | 42.37,65.53 40.87,67.03 U1.22 40.37,67.53 39.37,68.53 37.87,68.53 34.37,72.03 J4.1 | 42.87,63.53 58.87,63.53 72.37,50.03 72.37,41.03 J1.1 | 42.37,65.53 42.37,51.03 DRIVER.12 | 40.37,25.53 17.87,25.53 11.87,31.53 11.87,32.03 11.37,32.53 2.87,32.53 J5.1 | v44.45,12.7 44.45,16.52 50.42,22.49 50.42,23.23 49.9,23.75 49.16,23.75 47,21.59 v46.99,21.59
  pour Top: 0,74.93 74.93,74.93 74.93,0 0,0
  pour Bottom: 0,74.93 74.93,74.93 74.93,0 0,0
INSERT  (via drill 0.56)
  Top 0.152: 28.37,16.53 28.31,16.67 Q1.1 27.87,17.03 25.37,17.03 23.37,19.03 R4.1
  Top 0.762: J9.GND 20.55,7.62 v16.51,7.62 | v30.48,3.81 29.21,5.08 29.21,8.21 29.31,8.31 29.31,8.99 30.48,10.16 30.48,14.5 28.31,16.67
  Bottom 0.762: v16.51,7.62 16.51,2.54 17.43,1.62 20,1.4 29.34,1.4 30.48,2.54 v30.48,3.81
M_IN1
  Bottom 0.152: DRIVER.2 33.87,43.53 33.87,46.53 30.37,50.03 30.37,52.03 37.87,59.53 U1.6
M_IN2
  Bottom 0.152: DRIVER.7 46.87,43.53 46.87,48.53 45.87,49.53 45.87,55.03 50.37,59.53 U1.11
M_IN3
  Bottom 0.152: DRIVER.10 47.37,51.03 47.37,54.03 52.87,59.53 U1.12
M_IN4
  Top 0.152: DRIVER.15 34.37,51.03 34.37,61.03 54.87,61.03 55.87,60.03 U1.13
MOTOR1_A  (via drill 0.35)
  Top 0.152: v64.37,35.03 52.87,35.03 44.87,43.03 DRIVER.6
  Bottom 0.152: v64.37,35.03 70.87,28.53 MOTOR_2.1
MOTOR2_A  (via drill 0.35)
  Top 0.152: v17.87,28.03 17.37,27.53 6.37,27.53 3.87,25.03 MOTOR_1.1
  Bottom 0.152: v17.87,28.03 21.37,28.03 35.37,42.03 35.37,44.03 36.37,45.03 36.37,50.53 DRIVER.14
MOTOR2_B  (via drill 0.35)
  Top 0.152: v37.87,37.53 33.37,33.03 15.37,33.03 13.87,31.53 v10.87,31.53
  Bottom 0.152: v37.87,37.53 37.87,44.03 44.37,50.53 DRIVER.11 | v10.87,31.53 6.87,31.53 3.87,28.53 MOTOR_1.2
N$1
  Top 0.152: C17.1 23.37,16.53 23.37,18.03 22.87,18.03 19.87,21.03 19.87,21.53 18.37,21.53 17.87,22.03 17.87,24.03 20.87,24.03 22.37,25.53 22.37,30.03 U2.4
N$2
  Top 0.152: 27.87,29.03 27.87,30.03 27.37,30.03 U2.8 | 27.87,29.03 27.87,28.03 C7.1 | 27.87,29.03 43.37,29.03 43.37,26.53 42.37,25.53 28.37,25.53 27.87,25.03 Y2.3
N$3
  Top 0.152: R2.1 2.87,54.53 2.87,46.03 2.37,46.03 LED2.A
N$4  (via drill 0.35)
  Top 0.152: v36.87,34.53 38.87,32.53 47.37,32.53 54.87,25.03 70.87,25.03 MOTOR_2.2
  Bottom 0.152: v36.87,34.53 36.87,43.03 DRIVER.3
N$5
  Top 0.152: R16.1 16.37,23.03 16.37,25.03 17.37,25.03 D2.A
N$6  (via drill 0.35)
  Top 0.152: v48.37,40.53 55.87,40.53 56.87,41.53 R5.2
  Bottom 0.152: v48.37,40.53 41.87,34.03 BUZZER.+
N$8  (via drill 0.35)
  Top 0.152: v24.37,22.03 25.37,23.03 Y2.1 25.37,23.53 24.37,23.53 24.37,26.03 25.87,26.03 25.87,30.03 U2.7 | C2.1 6.35,12.77 v6.35,13.97
  Bottom 0.152: v6.35,13.97 6.35,16.51 11.87,22.03 v24.37,22.03
N$9
  Top 0.152: R12.1 11.37,23.53 10.37,24.53 10.37,26.03 13.87,26.03 D3.A
N$10
  Top 0.152: C9.2 61.87,49.53 61.87,54.53 59.87,54.53 Y3.2 59.37,55.03 50.37,55.03 45.87,59.53 U1.9
N$14
  Top 0.152: C10.1 64.87,47.03 64.87,54.53 Y3.1 64.37,55.03 63.37,56.03 51.87,56.03 48.37,59.53 U1.10
N$15
  Top 0.152: 69.37,27.03 61.37,27.03 60.37,28.03 IC3.1 | 69.37,27.03 73.37,27.03 73.37,24.53 71.37,22.53 62.87,22.53 54.87,14.53 R15.1 | 69.37,27.03 69.37,39.53 71.87,42.03 72.37,42.03 72.37,57.03 R14.2
N$23
  Top 0.152: U1.19 48.37,67.53 48.37,71.03 J7.3
N$28
  Top 0.152: U1.18 50.87,67.53 50.87,71.03 J7.2
N$29
  Top 0.152: U1.17 53.37,67.53 53.37,71.03 J7.1
PWRIN
  Top 0.762: 14.37,15.53 D1.A 13.97,12.7 14.06,12.61 J9.PWR
RESET  (via drill 0.35)
  Top 0.152: S1.3 13.37,33.03 13.37,38.03 S1.4 13.37,38.53 15.87,41.03 v16.87,41.03 | C8.2 19.37,22.53 20.37,23.53 22.37,23.53 R3.1 22.87,24.03 22.87,32.53 33.87,32.53 38.87,37.53 38.87,38.53 26.87,38.53 21.87,43.53 21.87,45.53 J8.1 21.87,46.03 25.37,46.03 25.37,59.53 U1.1
  Bottom 0.152: v16.87,41.03 21.37,45.53 J8.1
RX-I  (via drill 0.35)
  Top 0.152: D3.C 14.37,29.03 18.87,29.03 19.87,30.03 U2.2 19.87,30.53 v19.87,32.03
  Bottom 0.152: v19.87,32.03 27.87,40.03 27.87,59.53 U1.2
SHLD
  Top 0.152: J2.SHLD3 49.37,2.53 57.37,2.53 J2.SHLD4
  Bottom 0.152: J2.SHLD3 48.87,2.53 48.87,6.53 J2.SHLD1 | J2.SHLD2 57.87,6.53 57.87,2.53 J2.SHLD4
TRIG_1  (via drill 0.35)
  Top 0.152: v58.37,62.53 42.87,62.53 38.37,67.03 U1.23
  Bottom 0.152: v58.37,62.53 67.87,53.03 67.87,40.53 72.37,36.03 J1.3
TRIG_2
  Top 0.152: U1.25 33.37,67.53 36.87,71.03 38.37,71.03 39.37,72.03 J4.3
TRIG_3
  Bottom 0.152: U1.27 27.87,67.03 26.87,67.03 1.37,41.53 1.37,39.53 2.37,38.53 J5.3
TRIG_4  (via drill 0.35)
  Top 0.152: v54.37,27.03 53.37,27.03 41.37,39.03 33.37,39.03 33.37,59.53 U1.4 | v41.37,9.03 v41.37,17.03
  Bottom 0.152: v54.37,27.03 54.37,28.03 53.37,29.03 v41.37,17.03 | v41.37,9.03 41.37,7.53 36.87,3.03 J6.3
TX-O  (via drill 0.35)
  Top 0.152: D2.C 20.87,25.53 20.87,30.03 U2.3 20.87,30.53 v20.87,32.03
  Bottom 0.152: v20.87,32.03 29.87,41.03 29.87,59.03 30.37,59.53 U1.3
USBVCC  (via drill 0.35)
  Top 0.5: BYP.2 11.84,17.78
  Top 0.762: 6.87,20.03 9.37,20.03 9.37,18.03 v16.87,18.03 | 6.87,20.03 F2.2 | v38.87,18.03 29.87,18.03 29.37,18.53 Q1.3 | v42.37,14.53 47.87,14.53 C15.+ | v64.37,42.03 68.87,46.53 C12.1 | 6.87,20.03 6.87,19.05 12.7,19.05 12.7,17.78 11.84,17.78
  Bottom 0.762: v42.37,14.53 39.62,17.28 | 39.62,17.28 v38.87,18.03 v16.87,18.03 | 39.62,17.28 v64.37,42.03
VCC  (via drill 0.35)
  Top 0.152: R12.2 11.87,24.53 13.37,23.03 14.37,23.03 R16.2 | C18.1 17.87,18.03 17.87,21.53 15.87,21.53 14.87,22.53 R16.2 | R2.2 8.97,52.97 18.37,43.57 18.37,36.03 U2.16 18.37,35.53 v16.87,34.03 | v17.87,27.03 17.37,27.03 15.87,25.53 14.87,25.53 14.87,23.03 R16.2
  Bottom 0.152: v17.87,27.03 16.87,28.03 v16.87,34.03
VIN  (via drill 0.35)
  Top 0.762: v16.87,20.03 14.37,20.03 D1.C | DRIVER.8 49.87,43.03 58.37,43.03 60.37,41.03 65.37,41.03 65.37,34.53 64.87,34.03 61.37,34.03 60.37,33.03 IC3.3 59.87,32.53 59.37,32.53 v58.37,31.53 | v70.87,19.03 70.87,16.53 C5.+
  Bottom 0.762: v16.87,20.03 40.87,20.03 49.37,28.53 49.37,43.03 DRIVER.8 | v58.37,31.53 v70.87,19.03
VUSB  (via drill 0.35, 0.56)  (2 unrouted)
  Top 0.762: v57.87,10.03 60.37,10.03 JP14.VBUS | v55.88,8.89 55.88,8.29 55.7,8.11 | J2.VBUS1 50.89,8.8 v50.8,8.89 | v8.37,14.03 8.37,15.13 BYP.1 3.81,15.24 2.96,16.09 C1.1 2.96,18.2 3.81,19.05
  Bottom 0.762: 55.88,10.03 38.37,10.03 31.83,16.57 10.91,16.57 v8.37,14.03 | v57.87,10.03 55.88,10.03 | 55.88,10.03 v55.88,8.89 v50.8,8.89
(copper drawn outside any net)
  shapes: Top area x4

### Text on the board
Top: Otopilot Kaza | Onleme Sistemi | V1.1
Bottom: FATIH NAIM | TURKEL
tStop: Otopilot Kaza | Onleme Sistemi | V1.1
bStop: DESIGNED BY | FATIH NAIM | TURKEL